# EAGLE schematic External Sensor Schematic (EAGLE 8.4.2)
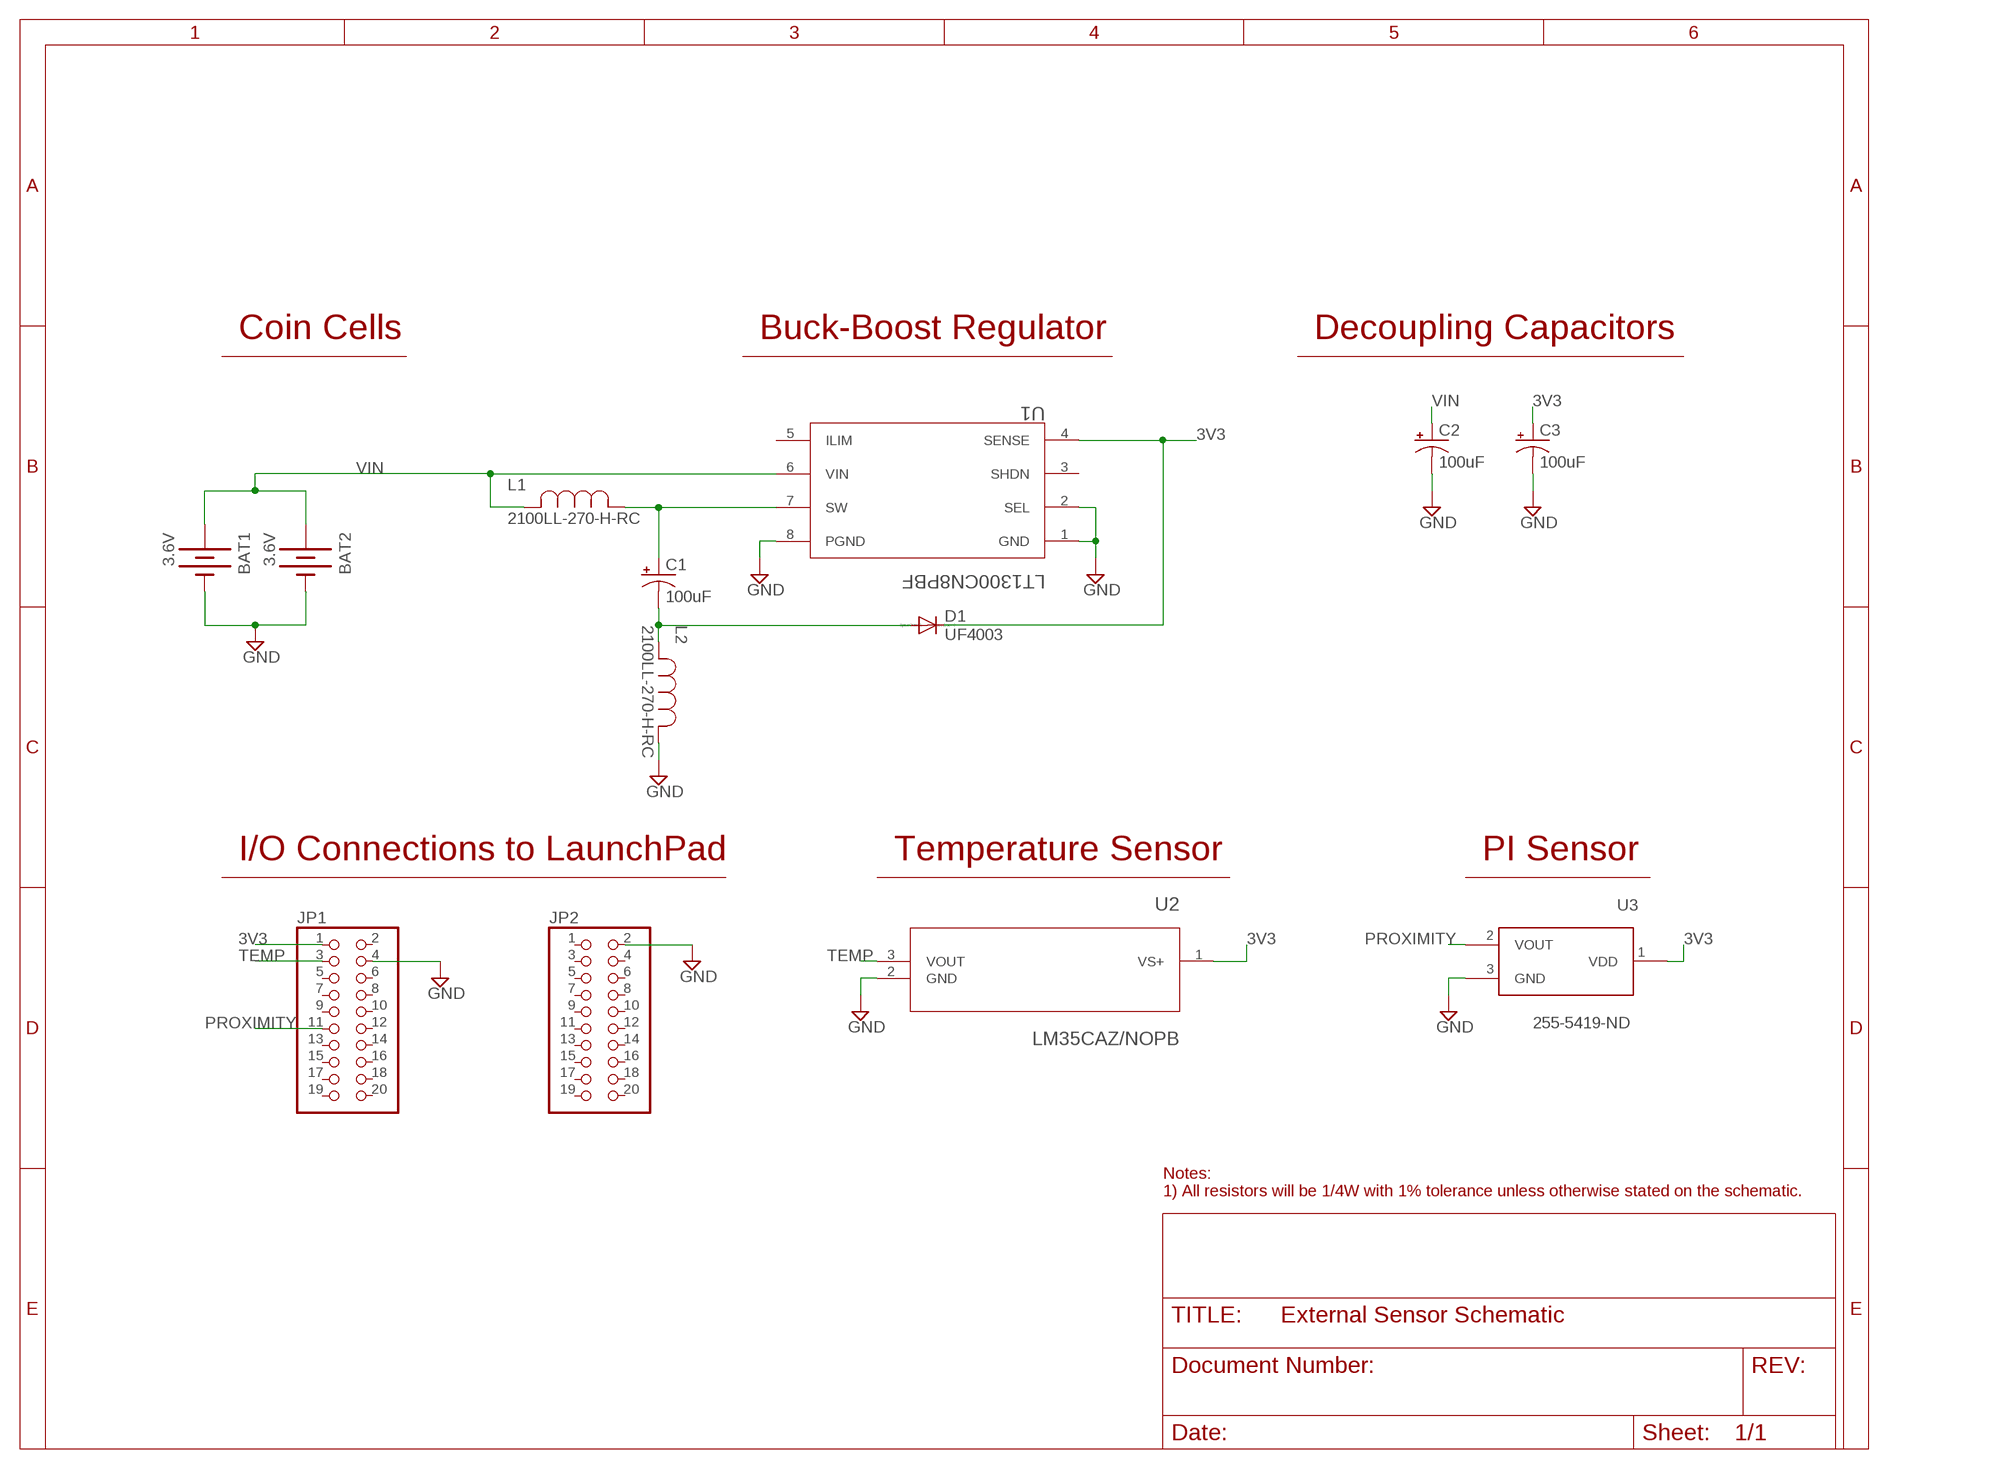
[diagram p0: schematic, sheet 1]

## Parts
BAT1  3.6V  BATTERY245PTH  [BATTCON_245MM_PTH]
BAT2  3.6V  BATTERY245PTH  [BATTCON_245MM_PTH]
C1  100uF  100UF-POLAR  [EEU-FR1H101]
C2  100uF  100UF-POLAR  [EEU-FR1H101]
C3  100uF  100UF-POLAR  [EEU-FR1H101]
D1  UF4003  [DO41-10]
JP1  PINHD-2X10  [2X10]
JP2  PINHD-2X10  [2X10]
L1  2100LL-270-H-RC  [IND_2100LL_42_H]
L2  2100LL-270-H-RC  [IND_2100LL_42_H]
U1  LT1300CN8PBF  [PDIP-8_N]
U2  LM35CAZ/NOPB  [Z03A]
U3  PI_SENSOR_255-5419-ND  [255-5419-ND]

## Nets
3V3: C3.P(+) D1.C JP1.1 U1.4(SENSE) U2.1(VS+) U3.VDD
GND: BAT1.2(-) BAT2.2(-) C2.G(-) C3.G(-) JP1.4 JP2.2 L2.1 U1.1(GND) U1.2(SEL) U1.8(PGND) U2.2(GND) U3.GND
N$1: C1.P(+) L1.1 U1.7(SW)
N$7: C1.G(-) D1.A L2.2
PROXIMITY: JP1.11 U3.VOUT
TEMP: JP1.3 U2.3(VOUT)
VIN: BAT1.3(+) BAT2.3(+) C2.P(+) L1.2 U1.6(VIN)
Unconnected: JP1.2 JP1.5 JP1.6 JP1.7 JP1.8 JP1.9 JP1.10 JP1.12 JP1.13 JP1.14 JP1.15 JP1.16 JP1.17 JP1.18 JP1.19 JP1.20 JP2.1 JP2.3 JP2.4 JP2.5 JP2.6 JP2.7 JP2.8 JP2.9 JP2.10 JP2.11 JP2.12 JP2.13 JP2.14 JP2.15 JP2.16 JP2.17 JP2.18 JP2.19 JP2.20 U1.3(SHDN) U1.5(ILIM)

## Notes on the sheet
- Coin Cells | Buck-Boost Regulator | Decoupling Capacitors
- I/O Connections to LaunchPad | Temperature Sensor | PI Sensor
- Notes:
  1) All resistors will be 1/4W with 1% tolerance unless otherwise stated on the schematic.

## Library data of the parts
BAT1 BAT2 = SparkFun-Electromechanical:BATTERY: Battery Holders Various common sizes : AA, AAA, 18650 (PRT-12895), 20mm coin cell and 12mm coin cell. 20MM_4LEGS, BATT-10373
C1-C3 = 100uF_Cap:100UF-POLAR: 100µF polarized capacitors A capacitor is a passive two-terminal electrical component used to store electrical energy temporarily in an electric field.
D1 = diode:UF4003: DIODE ultrafast recovery diode, 200 V rectifier
JP1 JP2 = SparkFun-Connectors:PINHD-2X10: PIN HEADER
L1 L2 = Inductor-27uH:2100LL-270-H-RC; MANUFACTURER_PART_NUMBER: 2100LL270HRC; VENDOR: Bourns Electronics
U1 = LT1300 BuckBoost:LT1300CN8PBF; MANUFACTURER_PART_NUMBER: LT1300CN8#PBF; VENDOR: Linear Technology
U2 = LM35_TH:LM35CAZ/NOPB; MANUFACTURER_PART_NUMBER: LM35CAZNOPB; VENDOR: Texas Instruments
U3 = PI Sensor 255-5419-ND:PI_SENSOR_255-5419-ND